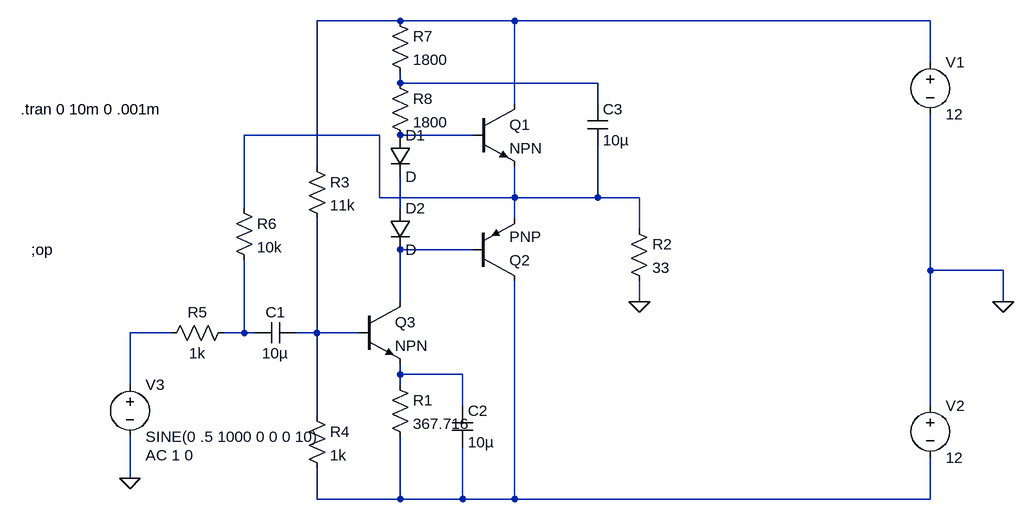
[diagram p0: schematic claseab_real.asc]
claseab_real.asc, the LTspice schematic file:
Version 4
SHEET 1 1028 680
WIRE 80 -560 -48 -560
WIRE 256 -560 80 -560
WIRE 896 -560 256 -560
WIRE 896 -496 896 -560
WIRE 80 -464 80 -480
WIRE 384 -464 80 -464
WIRE 256 -432 256 -560
WIRE 384 -432 384 -464
WIRE 48 -384 -160 -384
WIRE 192 -384 80 -384
WIRE -48 -336 -48 -560
WIRE 48 -288 48 -384
WIRE 256 -288 256 -336
WIRE 256 -288 48 -288
WIRE 384 -288 384 -368
WIRE 384 -288 256 -288
WIRE 448 -288 384 -288
WIRE -160 -272 -160 -384
WIRE 80 -272 80 -320
WIRE 256 -256 256 -288
WIRE 448 -240 448 -288
WIRE 192 -208 80 -208
WIRE 896 -176 896 -416
WIRE 1008 -176 896 -176
WIRE 80 -128 80 -208
WIRE 448 -128 448 -160
WIRE 1008 -128 1008 -176
WIRE -272 -80 -336 -80
WIRE -160 -80 -160 -192
WIRE -160 -80 -192 -80
WIRE -144 -80 -160 -80
WIRE -48 -80 -48 -256
WIRE -48 -80 -80 -80
WIRE 16 -80 -48 -80
WIRE 80 -16 80 -32
WIRE 176 -16 80 -16
WIRE -336 0 -336 -80
WIRE 80 0 80 -16
WIRE 176 32 176 -16
WIRE 896 32 896 -176
WIRE -48 48 -48 -80
WIRE -336 144 -336 80
WIRE -48 176 -48 128
WIRE 80 176 80 80
WIRE 80 176 -48 176
WIRE 176 176 176 96
WIRE 176 176 80 176
WIRE 256 176 256 -160
WIRE 256 176 176 176
WIRE 896 176 896 112
WIRE 896 176 256 176
FLAG 1008 -128 0
FLAG -336 144 0
FLAG 448 -128 0
DATAFLAG 384 -288 ""
SYMBOL voltage 896 -512 R0
WINDOW 123 0 0 Left 2
WINDOW 39 0 0 Left 2
SYMATTR InstName V1
SYMATTR Value 12
SYMBOL voltage 896 16 R0
WINDOW 123 0 0 Left 2
WINDOW 39 0 0 Left 2
SYMATTR InstName V2
SYMATTR Value 12
SYMBOL voltage -336 -16 R0
WINDOW 123 24 124 Left 2
WINDOW 39 0 0 Left 2
SYMATTR Value2 AC 1 0
SYMATTR InstName V3
SYMATTR Value SINE(0 .5 1000 0 0 0 10)
SYMBOL diode 64 -384 R0
SYMATTR InstName D1
SYMBOL diode 64 -272 R0
SYMATTR InstName D2
SYMBOL res 432 -256 R0
SYMATTR InstName R2
SYMATTR Value 33
SYMBOL npn 192 -432 R0
SYMATTR InstName Q1
SYMBOL pnp 192 -160 M180
SYMATTR InstName Q2
SYMBOL npn 16 -128 R0
SYMATTR InstName Q3
SYMBOL res 64 -16 R0
SYMATTR InstName R1
SYMATTR Value 367.716
SYMBOL res -64 -352 R0
SYMATTR InstName R3
SYMATTR Value 11k
SYMBOL res -64 32 R0
SYMATTR InstName R4
SYMATTR Value 1k
SYMBOL cap -80 -96 R90
WINDOW 0 0 32 VBottom 2
WINDOW 3 32 32 VTop 2
SYMATTR InstName C1
SYMATTR Value 10µ
SYMBOL cap 160 32 R0
SYMATTR InstName C2
SYMATTR Value 10µ
SYMBOL res -176 -96 R90
WINDOW 0 0 56 VBottom 2
WINDOW 3 32 56 VTop 2
SYMATTR InstName R5
SYMATTR Value 1k
SYMBOL res -176 -288 R0
SYMATTR InstName R6
SYMATTR Value 10k
SYMBOL res 64 -576 R0
SYMATTR InstName R7
SYMATTR Value 1800
SYMBOL res 64 -480 R0
SYMATTR InstName R8
SYMATTR Value 1800
SYMBOL cap 368 -432 R0
SYMATTR InstName C3
SYMATTR Value 10µ
TEXT -504 -424 Left 2 !.tran 0 10m 0 .001m
TEXT -488 -208 Left 2 !;op

The netlist it stands for:
* claseab_real.asc
V1 N001 0 12
V2 0 N011 12
V3 N007 0 SINE(0 .5 1000 0 0 0 10) AC 1 0
D1 N004 N005 D
D2 N005 N006 D
R2 N003 0 33
Q1 N001 N004 N003 0 NPN
Q2 N011 N006 N003 0 PNP
Q3 N006 N009 N010 0 NPN
R1 N010 N011 367.716
R3 N001 N009 11k
R4 N009 N011 1k
C1 N009 N008 10µ
C2 N010 N011 10µ
R5 N008 N007 1k
R6 N003 N008 10k
R7 N001 N002 1800
R8 N002 N004 1800
C3 N002 N003 10µ
.model D D
.lib standard.dio
.model NPN NPN
.model PNP PNP
.lib standard.bjt
.tran 0 10m 0 .001m
;op
.backanno
.end